# Altium schematic sheet Pressure Sensor Breakout.SchDoc
size B
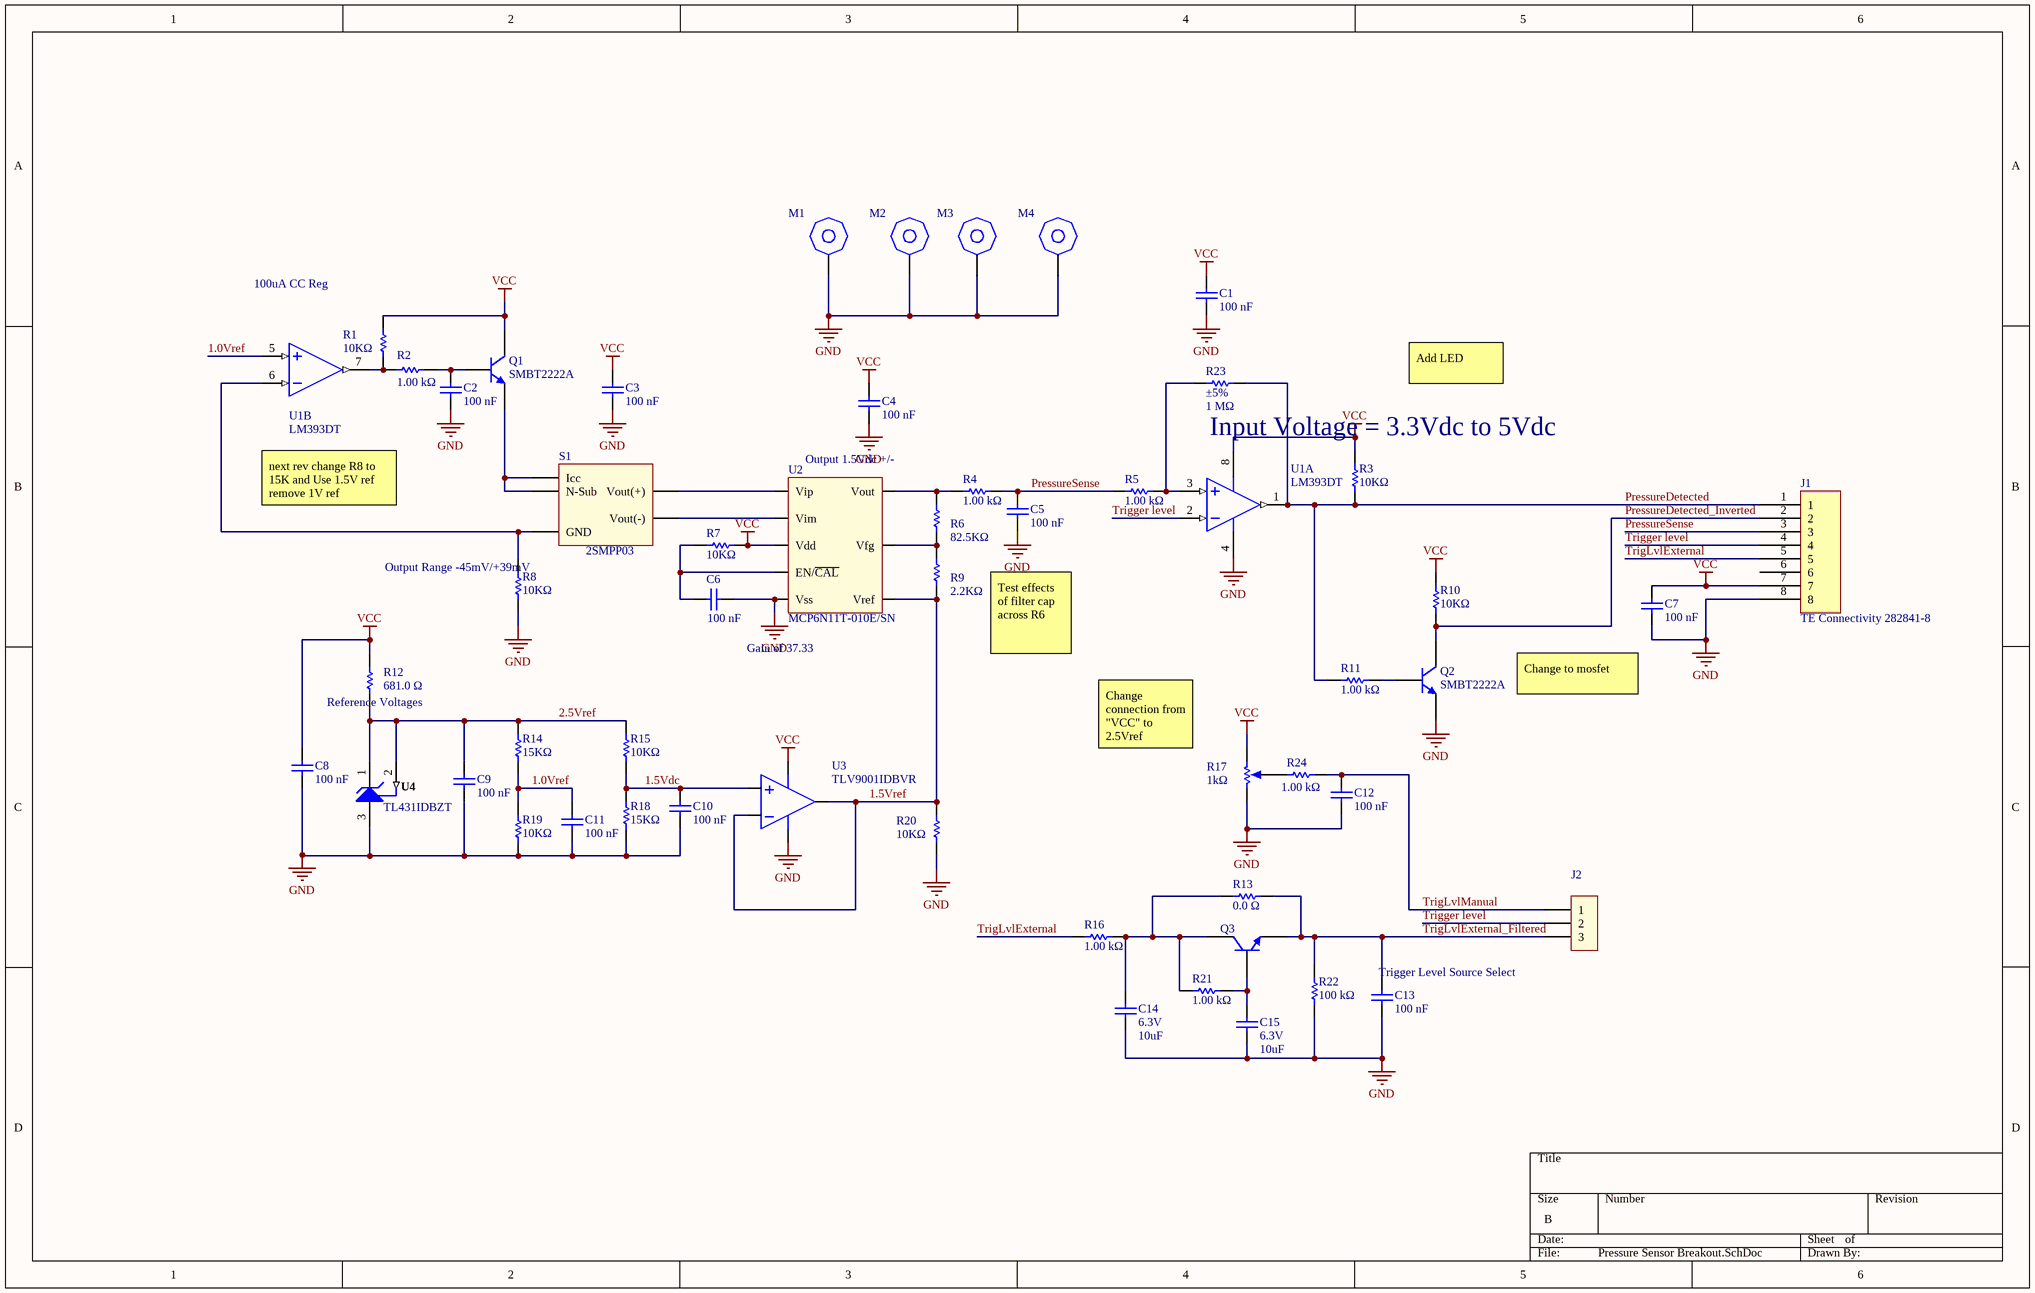
[diagram p0: Pressure Sensor Breakout.SchDoc]

## Parts
C1  Capacitance: 100 nF  [Cap,0805]  (hidden comment: 08055C104JAT2A)
C2  Capacitance: 100 nF  [Cap,0805]  (hidden comment: 08055C104JAT2A)
C3  Capacitance: 100 nF  [Cap,0805]  (hidden comment: 08055C104JAT2A)
C4  Capacitance: 100 nF  [Cap,0805]  (hidden comment: 08055C104JAT2A)
C5  Capacitance: 100 nF  [Cap,0805]  (hidden comment: 08055C104JAT2A)
C6  Capacitance: 100 nF  [Cap,0805]  (hidden comment: 08055C104JAT2A)
C7  Capacitance: 100 nF  [Cap,0805]  (hidden comment: 08055C104JAT2A)
C8  Capacitance: 100 nF  [Cap,0805]  (hidden comment: 08055C104JAT2A)
C9  Capacitance: 100 nF  [Cap,0805]  (hidden comment: 08055C104JAT2A)
C10  Capacitance: 100 nF  [Cap,0805]  (hidden comment: 08055C104JAT2A)
C11  Capacitance: 100 nF  [Cap,0805]  (hidden comment: 08055C104JAT2A)
C12  Capacitance: 100 nF  [Cap,0805]  (hidden comment: 08055C104JAT2A)
C13  Capacitance: 100 nF  [Cap,0805]  (hidden comment: 08055C104JAT2A)
C14  Voltage - Rated: 6.3V  Capacitance: 10uF  [Cap,0805]  (hidden comment: Cap)
C15  Voltage - Rated: 6.3V  Capacitance: 10uF  [Cap,0805]  (hidden comment: Cap)
J1  TE Connectivity 282841-8  [Conn, wire to pcb terminal,282841-8]
J2  Generic Header  [Header,3POS,0.1",Vert]  (value not drawn)
M1  M3 hex Standoff  [Standoff,Hex,M3,8mm]  (value not drawn)
M2  M3 hex Standoff  [Standoff,Hex,M3,8mm]  (value not drawn)
M3  M3 hex Standoff  [Standoff,Hex,M3,8mm]  (value not drawn)
M4  M3 hex Standoff  [Standoff,Hex,M3,8mm]  (value not drawn)
Q1  SMBT2222A  [SOT23-3]
Q2  SMBT2222A  [SOT23-3]
Q3  NPN  [SOT23-3]  (value not drawn)
R1  Resistance: 10KΩ  [res, 0805, HD]  (hidden comment: Vishay / Dale CRCW080510K0FKTA)
R2  Resistance: 1.00 kΩ  [res, 0805, HD]  (hidden comment: Vishay CRCW08051K00JNEA)
R3  Resistance: 10KΩ  [res, 0805, HD]  (hidden comment: Vishay / Dale CRCW080510K0FKTA)
R4  Resistance: 1.00 kΩ  [res, 0805, HD]  (hidden comment: Vishay CRCW08051K00JNEA)
R5  Resistance: 1.00 kΩ  [res, 0805, HD]  (hidden comment: Vishay CRCW08051K00JNEA)
R6  Resistance: 82.5KΩ  [res, 0805, HD]  (hidden comment: TNPW080582K5BEEA)
R7  Resistance: 10KΩ  [res, 0805, HD]  (hidden comment: Vishay / Dale CRCW080510K0FKTA)
R8  Resistance: 10KΩ  [res, 0805, HD]  (hidden comment: Vishay / Dale CRCW080510K0FKTA)
R9  Resistance: 2.2KΩ  [res, 0805, HD]  (hidden comment: CRCW08052K20FKEA)
R10  Resistance: 10KΩ  [res, 0805, HD]  (hidden comment: Vishay / Dale CRCW080510K0FKTA)
R11  Resistance: 1.00 kΩ  [res, 0805, HD]  (hidden comment: Vishay CRCW08051K00JNEA)
R12  Resistance: 681.0 Ω  [res, 0805, HD]  (hidden comment: CRCW0805681RFKEA)
R13  Resistance: 0.0 Ω  [res, 0805, HD]  (hidden comment: Res1)
R14  Resistance: 15KΩ  [res, 0805, HD]  (hidden comment: CRGCQ0805F15K)
R15  Resistance: 10KΩ  [res, 0805, HD]  (hidden comment: Vishay / Dale CRCW080510K0FKTA)
R16  Resistance: 1.00 kΩ  [res, 0805, HD]  (hidden comment: Vishay CRCW08051K00JNEA)
R17  Resistance: 1kΩ  [Res,SMD,POT,TC33 Series]  (hidden comment: TC33X-2-102E)  (mechanical)
R18  Resistance: 15KΩ  [res, 0805, HD]  (hidden comment: CRGCQ0805F15K)
R19  Resistance: 10KΩ  [res, 0805, HD]  (hidden comment: Vishay / Dale CRCW080510K0FKTA)
R20  Resistance: 10KΩ  [res, 0805, HD]  (hidden comment: Vishay / Dale CRCW080510K0FKTA)
R21  Resistance: 1.00 kΩ  [res, 0805, HD]  (hidden comment: Vishay CRCW08051K00JNEA)
R22  Resistance: 100 kΩ  [res, 0805, HD]  (hidden comment: Res,0805,100kΩ,1%,100ppm,CRCW0805100KFKEA)
R23  Tolerance: ±5%  Resistance: 1 MΩ  [res, 0805, HD]  (hidden comment: CR0805-JW-105ELF)
R24  Resistance: 1.00 kΩ  [res, 0805, HD]  (hidden comment: Vishay CRCW08051K00JNEA)
S1  2SMPP03  [2SMPP03,6-SMD Module]
U1  LM393DT  [SOIC-8]  (parts A,B of 2)
U2  MCP6N11T-010E/SN  [SOIC-8]
U3  TLV9001IDBVR  [SOT23-5]
U4  Manufacturer Part Number: TL431IDBZT  [SOT23-3]  (hidden comment: Shunt Regulator,2.5Vdc TL431IDBZT)

## Nets
GND: C1.2 C2.2 C3.2 C4.2 C5.2 C6.1 C7.2 C8.2 C9.2 C10.2 C11.2 C12.2 C13.2 C14.1 C15.1 J1.8 M1.0 M2.0 M3.0 M4.0 Q2.2(E) R8.1 R17.1 R18.1 R19.1 R20.1 R22.1 U1.4(Gnd) U2.4(Vss) U3.2(V-) U4.3(ANODE)
VCC: C1.1 C3.1 C4.1 C7.1 C8.1 J1.7 Q1.3(C) R1.2 R3.2 R7.2 R10.2 R12.2 R17.3 U1.8(Vcc) U2.7(Vdd) U3.5(V+)
1.0Vref: C11.1 R14.1 R19.2 U1.5(IN2+)
1.5Vdc: C10.1 R15.1 R18.2 U3.3(IN+)
1.5Vref: R9.1 R20.2 U2.5(Vref) U3.1(Out) U3.4(IN-)
2.5Vref: C9.1 R12.1 R14.2 R15.2 U4.1(CATHODE) U4.2(REF)
PressureDetected: J1.1 R3.1 R11.2 R23.1 U1.1(OUT1)
PressureDetected_Inverted: J1.2 Q2.3(C) R10.1
PressureSense: C5.1 J1.3 R4.1 R5.1
Trigger level: J1.4 J2.2 U1.2(IN1-)
TrigLvlExternal: J1.5 R16.1
TrigLvlExternal_Filtered: C13.1 J2.3 Q3.3(E) R13.1 R22.2
TrigLvlManual: C12.1 J2.1 R24.1
NetC2_1: C2.1 Q1.1(B) R2.1
NetC6_2: C6.2 R7.1 U2.8(EN/~{CAL})
NetC14_2: C14.2 Q3.1(C) R13.2 R16.2 R21.2
NetC15_2: C15.2 Q3.2(B) R21.1
NetQ1_2: Q1.2(E) S1.5(N-Sub) S1.6(Icc)
NetQ2_1: Q2.1(B) R11.1
NetR1_1: R1.1 R2.2 U1.7(OUT2)
NetR4_2: R4.2 R6.2 U2.6(Vout)
NetR5_2: R5.2 R23.2 U1.3(IN1+)
NetR6_1: R6.1 R9.2 U2.1(Vfg)
NetR8_2: R8.2 S1.3(GND) U1.6(IN2-)
NetR17_2: R17.2 R24.2
NetS1_1: S1.1(Vout(+)) U2.3(Vip)
NetS1_4: S1.4(Vout(-)) U2.2(Vim)

Not connected (* = marked no-connect by the designer): J1 6; S1 2(NC)

## Notes on the sheet
- (near R1) 100uA CC Reg
- Add LED
- Input Voltage = 3.3Vdc to 5Vdc
- next rev change R8 to 15K and Use 1.5V ref
  remove 1V ref
- Output 1.5Vdc +/-
- (near R8) Output Range -45mV/+39mV
- (near U2) Gain of 37.33
- (near R14) Reference Voltages
- Test effects of filter cap across R6
- (near C7) Change to mosfet
- Change connection from "VCC" to 2.5Vref
- (near J2) Trigger Level Source Select

## Library data of the parts
C1-C13 = Cap,0805,100nf,50V,5%,08055C104JAT2A: Capacitor; Ceramic; Cap 0.1 uF; Tol 5%; Vol-Rtg 50 VDC; SMT; 0805; X7R; Tape & Reel; Lead-Free Status: Lead Free; Case/Package (SI): 2012; Insulation Resistance: 100 GΩ; Detailed Description: 0.1µF ±5% 50V Ceramic Capacitor X7R 0805 (2012 Metric); Voltage Rating (DC): 50.0 V; Mounting Style: Surface Mount; Packaging: Tape & Reel (TR), Cut Tape (CT); RoHS: Compliant; Size-Width: 1.24 mm; Case/Package: 0805; Number of Pins: 2; digikey url: http://www.digikey.ca/product-detail/en/avx-corporation/08055C104JAT2A/478-3352-1-ND/930144; REACH SVHC Compliance: No SVHC; Dielectric Characteristic: X7R; Capacitance Tolerance: ±5%; Size-Length: 2.01 mm; Size-Height: 710 µm; Size-Thickness: 940 µm; Manufacturer Part Number: 08055C104JAT2A; Octopart URL: http://octopart.com/08055c104jat2a-avx-55388010; Operating Temperature: -55°C ~ 125°C; Supplier 1: Digi-Key; Supplier Part Number 1: 478-3352-1-ND
C14 C15 = Cap,0805,10uf,6.3V,10%,CL21A106KQFNNNG: CL21 Series 10 uF 6.3V ±10 % Tolerance X5R SMT Multilayer Ceramic Capacitor; Lead-Free Status: Lead Free; Tolerance: ±10%; Other Names: 1276-6457-2; RoHS: Compliant; mfg P/N: CL21A106KQFNNNG; Mounting Style: Surface Mount; Operating Temperature: -55°C ~ 85°C; Applications: General Purpose; Package / Case: 0805 (2012 Metric)
J1 = Connector, Terminal, PCB, 8 Pos,282841-8: Buchanan; Conn; Term Blk; PCB; 8; 5.08 mm; 30-12 AWG; Green; 17.5 A; 300 V; Lead-Free Status: Lead Free; Number of Contacts: 8; Pin Pitch: 5.08 mm; ELV Compliant: Compliant; Size-Width: 9.00 mm; Lifecycle Status: Active; Number of Rows: 1; Mounting Style: Through Hole, Screw; RoHS: Compliant; Housing Material: Nylon 6/6; Size-Length: 40.6 mm; Housing Color: Green; Number of Positions: 8; Size-Height: 15.2 mm; Octopart URL: http://octopart.com/282841-8-te+connectivity-39539776; Contact Plating: Tin; Contact Material: Brass; Flammability Rating: UL 94 V-0; Manufacturer Part Number: 282841-8; Supplier 1: Digi-Key; Supplier Part Number 1: A98345-ND
J2 = Header 1x3,0.1",TH,Generic: Generic Header 3 pos header 0.1"
M1-M4 = Mech,Standoff, M3, Hex: HEX STANDOFF M3,generic; Supplier 1: Digi-Key; Supplier Part Number 1: 36-24314-ND
Q1-Q3 = Trans,40V,600mA,0.33W, SMBT2222A: NPN Silicon Switching Transistor, 40 V VCEO, 600 mA IC, SOT23, Reel, Green; Power Dissipation: 0.33 W; Voltage - Collector Emitter Breakdown (Max): 40V; Vce Saturation (Max) @ Ib, Ic: 1V @ 50mA, 500mA; Current - Collector Cutoff (Max): 10nA (ICBO); DC Current Gain (hFE) (Min) @ Ic, Vce: 100 @ 150mA, 10V; Frequency - Transition: 300MHz; Mounting Style: Surface Mount; Number of Pins: 3; Packaging: Cut Tape (CT); Polarity: NPN; REACH SVHC Compliance: No SVHC; RoHS: Compliant; Mounting Type: Surface Mount; Package / Case: TO-236-3, SC-59, SOT-23-3; Supplier Device Package: SOT-23-3; mfg P/N: SMBT2222A
  Q1 Q2: Supplier 1: Digi-Key; Supplier Part Number 1: SMBT2222AE6327HTSA1CT-ND; Supplier 2: Digi-Key; Supplier Part Number 2: MMBT2222ALT1HTSA1CT-ND; Supplier 3: Digi-Key; Supplier Part Number 3: SMBT2222AE6327HTSA1DKR-ND; Supplier 4: LCSC; Supplier Part Number 4: C151510
R1 R3 R7 R8 R10 R15 R19 R20 = Res,0805,10.0kΩ,1%,100 ppm,CRCW080510K0FKTA: RES SMD 10K OHM 1% 1/8W 0805; Temperature Coefficient: 100.0 ppm/C; Lead-Free Status: Contains Lead; Voltage Rating (DC): 150.0 V; Power Rating: 0.125 W; Case/Package (SI): 2012; Size-Width: 0.00125 m; Resistance Tolerance: 1%; Size-Length: 0.002 m; RoHS: Non-Compliant; Power Dissipation: 0.125 W; Number of Pins: 2; REACH SVHC Compliance: No SVHC; Size-Height: 0.00045 m; Case/Package: 0805; Mounting Style: Surface Mount; Supplier 1: Digi-Key; Supplier Part Number 1: 541-3016-1-ND
R2 R4 R5 R11 R16 R21 R24 = Res,0805,1.00 kΩ,5%,200ppm,CRCW08051K00JNEA: Res Thick Film 0805 1K Ohm 5% 0.125W(1/8W) ±200ppm/C Molded SMD Automotive Paper T/R; Power Rating: 125 mW; Case/Package (SI): 2012; Lead-Free Status: Lead Free; Temperature Coefficient: 200 ppm/°C; Voltage Rating (DC): 150 V; Size-Width: 1.25 mm; Mounting Style: Surface Mount; REACH SVHC Compliance: No SVHC; Manufacturer Part Number: CRCW08051K00JNEA; Number of Pins: 2; Size-Height: 450 µm; Packaging: Tape & Reel (TR), Cut Tape (CT); RoHS: Compliant; Resistance Tolerance: ±5%; Case/Package: 0805; Size-Length: 2.00 mm
  R2 R4 R5 R11 R24: Supplier 1: Digi-Key; Supplier Part Number 1: 541-1.0KADKR-ND; Supplier 2: Digi-Key; Supplier Part Number 2: 541-1.0KACT-ND
R6 = Res,0805,82.5KΩ,0.1%,25ppm, TNPW080582K5BEEA: 82.5 kOhms ±0.1% 0.2W, 1/5W Chip Resistor 0805 (2012 Metric) Anti-Sulfur, Automotive AEC-Q200, Moisture Resistant Thin Film; Manufacturer: Vishay Dale; Temperature Coefficient: ±25ppm/°C; mfg P/N: TNPW080582K5BEEA; Power (Watts): 0.2W, 1/5W; Composition: Thin Film; Features: Anti-Sulfur, Automotive AEC-Q200, Moisture Resistant; Operating Temperature: -55°C ~ 155°C; Package / Case: 0805 (2012 Metric); Supplier Device Package: 0805; Supplier 1: Digi-Key; Supplier Part Number 1: 541-3231-1-ND; Tolerance: ±0.1%
R9 = Res,0805,2.2KΩ,±1%,100.0 ppm/°C,150.0 V,CRCW08052K20FKEA: RES SMD 2.2K OHM 1% 1/8W 0805; Case/Package (SI): 2012; Lead-Free Status: Lead Free; Power Rating: 0.125 W; Voltage Rating (DC): 150.0 V; Case/Package: 0805; Mounting Style: Surface Mount; Number of Pins: 2; REACH SVHC Compliance: No SVHC; Resistance Tolerance: ±1%; RoHS: Compliant; Size-Height: 0.00045 m; Size-Length: 0.002 m; Size-Width: 0.00125 m; Temperature Coefficient: 100.0 ppm/°C; mfg P/N: CRCW08052K20FKEA; Supplier 1: Digi-Key; Supplier Part Number 1: 541-2.20KCCT-ND
R12 = Res,0805,681.0 Ω,±1%,100.0 ppm/°C,150.0 V,CRCW0805681RFKEA: RES SMD 681 OHM 1% 1/8W 0805; Case/Package (SI): 2012; Lead-Free Status: Lead Free; Power Rating: 0.125 W; Voltage Rating (DC): 150.0 V; Case/Package: 0805; Mounting Style: Surface Mount; Number of Pins: 2; Octopart Url: https://octopart.com/crcw0805681rfkea-vishay-39820193; REACH SVHC Compliance: No SVHC; Resistance Tolerance: ±1%; RoHS: Compliant; Size-Height: 0.00045 m; Size-Length: 0.002 m; Size-Width: 0.00125 m; Temperature Coefficient: 100.0 ppm/°C; mfg P/N: CRCW0805681RFKEA; Supplier 1: Digi-Key; Supplier Part Number 1: 541-681CCT-ND
R13 = Res,0805,0.0Ω,150V: RES SMD 0.0 OHM JUMPER 1/3W 0805; Lead-Free Status: Lead Free; Power Rating: 0.125 W; Voltage Rating (DC): 150.0 V; Case/Package: 0805; Number of Pins: 2; Octopart Url: https://octopart.com/crcw08050000z0eahp-vishay-44321084; RoHS: Compliant
R14 R18 = Res,0805,15KΩ,1%,±100ppm/°C,CRGCQ0805F15K: 15 kOhms ±1% 0.125W, 1/8W Chip Resistor 0805 (2012 Metric) Automotive AEC-Q200, Moisture Resistant Thick Film; mfg P/N: CRGCQ0805F15K; Tolerance: ±1%; Power (Watts): 0.125W, 1/8W; Composition: Thick Film; Features: Automotive AEC-Q200, Moisture Resistant; Temperature Coefficient: ±100ppm/°C; Operating Temperature: -55°C ~ 155°C; Package / Case: 0805 (2012 Metric); Supplier Device Package: 0805; Supplier 1: Digi-Key; Supplier Part Number 1: A129763CT-ND
R17 = Res,POT,SMD,1kΩ,0.1W, TC33X-2-102E: TRIMMER 1k OHM 0.1W J LEAD TOP; Manufacturer: Bourns Inc.; Detailed Description: 1k Ohms 0.1W, 1/10W J Lead Surface Mount Trimmer Potentiometer Cermet 1 Turn Top Adjustment; Power (Watts): 0.1W, 1/10W; Tolerance: ±25%; Temperature Coefficient: ±250ppm/°C; Adjustment Type: Top Adjustment; Resistive Material: Cermet; Number of Turns: 1; mfg P/N: TC33X-2-102E; Datasheets: TC33 Series; Category: Potentiometers, Variable Resistors  Trimmer Potentiometers; Series: Trimpot® TC33 - Open Frame; Part Status: Active; Mounting Type: Surface Mount; Termination Style: J Lead; Size / Dimension: Rectangular - 0.150"" x 0.142"" Face x 0.047"" H (3.80mm x 3.60mm x 1.20mm); Supplier 1: Digi-Key; Supplier 2: Digi-Key; Supplier 3: Digi-Key; Supplier Part Number 3: TC33X-102ECT-ND
R22 = Res,0805,100kΩ,1%,100ppm,CRCW0805100KFKEA: 100 kOhms ±1% 0.125W, 1/8W Chip Resistor 0805 (2012 Metric) Thick Film; Manufacturer: Vishay; Lead-Free Status: Lead Free; Case/Package (SI): 2012; Power Rating: 125 mW; Temperature Coefficient: -100 ppm/°C to 100 ppm/°C; Resistance Tolerance: ±1%; RoHS: Compliant; Manufacturer Part Number: CRCW0805100KFKEA; Number of Pins: 2; Size-Length: 2.00 mm; Packaging: Tape & Reel (TR), Reel, Cut Tape (CT); Size-Height: 450 µm; Case/Package: 0805; Size-Width: 1.25 mm; Operating Temperature: 150 °C (max); Supplier 1 Part Number: 679-0803; Supplier 1: RS
R23 = Res,0805,1MegΩ,5%,200ppm,0805W8F1005T5E: RES SMD 1M OHM 5% 1/8W 0805; Manufacturer: Bourns Inc.; Detailed Description: 1 MOhms ±5% 0.125W, 1/8W Chip Resistor 0805 (2012 Metric) Moisture Resistant Thick Film; Power (Watts): 0.125W, 1/8W; Temperature Coefficient: ±200ppm/°C; mfg P/N: CR0805-JW-105ELF; Category: Resistors  Chip Resistor - Surface Mount; Series: CR0805; Part Status: Active; Composition: Thick Film; Features: Moisture Resistant; Operating Temperature: -55°C ~ 155°C; Package / Case: 0805 (2012 Metric); Supplier Device Package: 0805; Size / Dimension: 0.079"" L x 0.049"" W (2.00mm x 1.25mm); Height - Seated (Max): 0.024"" (0.60mm); Supplier 1: Digi-Key; Supplier Part Number 1: CR0805-JW-105ELFCT-ND; JLC ALt LCSC Part #: C26108
S1 = Sensor,PRESSURE,Air, ±7.25PSI, 2SMPP03: SENSOR PRESSURE -50-50 KPA PCB; Manufacturer: Omron Electronics Inc-EMC Div; Detailed Description: Pressure Sensor ±7.25PSI (±50kPa) Compound Male - 0.1" (2.59mm) Tube -43 mV ~ 42 mV 6-SMD Module; Pressure Type: Compound; Operating Pressure: ±7.25PSI (±50kPa); Output Type: Analog Voltage; Output: -43 mV ~ 42 mV; Accuracy: ±0.5%; Port Size: Male - 0.1"" (2.59mm) Tube; Port Style: Barbless; Maximum Pressure: -11.6PSI ~ 17.4PSI (-80kPa ~ 120kPa); Category: Sensors, Transducers  Pressure Sensors, Transducers; Series: 2SMPP; Part Status: Active; Applications: Board Mount; Termination Style: Gull Wing; Operating Temperature: -10°C ~ 100°C; Package / Case: 6-SMD Module; Supplier 1: Digi-Key; Supplier Part Number 1: Z3639-ND; mfg P/N: 2SMPP03
U1 = OPAMP,DUAL,COMAPRATOR,SOIC8,OPEN-COLLECTOR,LM393DT: IC COMPARATOR LP DUAL 8-SOIC; Manufacturer: STMicroelectronics; Number of Elements: 2; Output Type: CMOS, DTL, ECL, MOS, Open-Collector, TTL; Voltage - Supply, Single/Dual (±): 2V ~ 36V, ±1V ~ 18V; Voltage - Input Offset (Max): 5mV @ 30V; Current - Input Bias (Max): 0.25µA @ 5V; Current - Output (Typ): 18mA @ 5V; Current - Quiescent (Max): 2.5mA; Package / Case 8-SOIC: (0.154", 3.90mm Width); mfg P/N:: LM393DT; Part Status: Active; Type: General Purpose; Operating Temperature: 0°C ~ 70°C; Mounting Type: Surface Mount; Supplier Device Package: 8-SO; Base Part Number: LM393; Supplier 1: Digi-Key; Supplier Part Number 1: 497-1593-1-ND; Supplier 2: LCSC; Supplier Part Number 2: C32901
U2 = Opamp,Instrumentation,SOIC,5Mhz,RailToRail, MCP6N11T-010E/SN: IC INST AMP 1 CIRCUIT 8SOIC; Manufacturer: Microchip Technology; Voltage - Input Offset: 500µV; Detailed Description: Instrumentation Amplifier 1 Circuit Rail-to-Rail 8-SOIC; Output Type: Rail-to-Rail; Slew Rate: 9V/µs; Current - Supply: 800µA; Voltage - Supply, Single/Dual (±): 1.8V ~ 5.5V; Number of Circuits: 1; Gain Bandwidth Product: 5MHz; Current - Input Bias: 10pA; mfg P/N: MCP6N11T-010E/SN; Supplier Device Package: 8-SOIC; Category: Integrated Circuits (ICs)  Linear - Amplifiers - Instrumentation, OP Amps, Buffer Amps; Part Status: Active; Amplifier Type: Instrumentation; Operating Temperature: -40°C ~ 125°C; Mounting Type: Surface Mount; Package / Case: 8-SOIC (0.154"", 3.90mm Width); Base Product Number: MCP6N11; Supplier 1: Digi-Key; Supplier Part Number 1: MCP6N11T-010E/SNCT-ND
U3 = OPAMP,Single,1Mhz,RailToRail,SOT-5, TLV9001IDBVR: IC CMOS 1 CIRCUIT SOT23-5; Manufacturer: Texas Instruments; Output Type: Rail-to-Rail; Detailed Description: CMOS Amplifier 1 Circuit Rail-to-Rail SOT-23-5; Slew Rate: 2V/µs; Current - Supply: 60µA; Voltage - Supply, Single/Dual (±): 1.8V ~ 5.5V, ±0.9V ~ 2.75V; Number of Circuits: 1; Gain Bandwidth Product: 1MHz; Current - Input Bias: 5pA; Voltage - Input Offset: 400µV; Current - Output / Channel: 40mA; Base Product Number: TLV900; Supplier 1: Digi-Key; Supplier Part Number 1: 296-TLV9001IDBVRCT-ND; Supplier 2: LCSC; Supplier Part Number 2: C398363; Supplier 3: Digi-Key; Supplier Part Number 3: TLV9001IDBVR-ND; mfg P/N: TLV9001IDBVR; Category: Integrated Circuits (ICs)  Linear - Amplifiers - Instrumentation, OP Amps, Buffer Amps; Part Status: Active; Amplifier Type: CMOS; Operating Temperature: -40°C ~ 125°C; Mounting Type: Surface Mount; Package / Case: SC-74A, SOT-753; Supplier Device Package: SOT-23-5
U4 = Shunt Regulator,2.5Vdc TL431IDBZT: Adjustable Precision Shunt Regulator, 34 ppm / degC, 100 mA, -40 to 85 degC, 3-pin SOT-23 (DBZ), Green (RoHS & no Sb/Br); Lead-Free Status: Lead Free; Output Current: 0.1 A; Temperature Coefficient: 34.0 ppm/°C; Case/Package: SOT-23; Lifecycle Status: Active; Number of Pins: 3; Octopart Url: https://octopart.com/tl431idbzt-texas+instruments-843706; OctopartID: acb465b256687373; Packaging: Cut Tape (CT); RoHS: Compliant; Supplier 1: Digi-Key; Supplier Part Number 1: 296-26719-1-ND